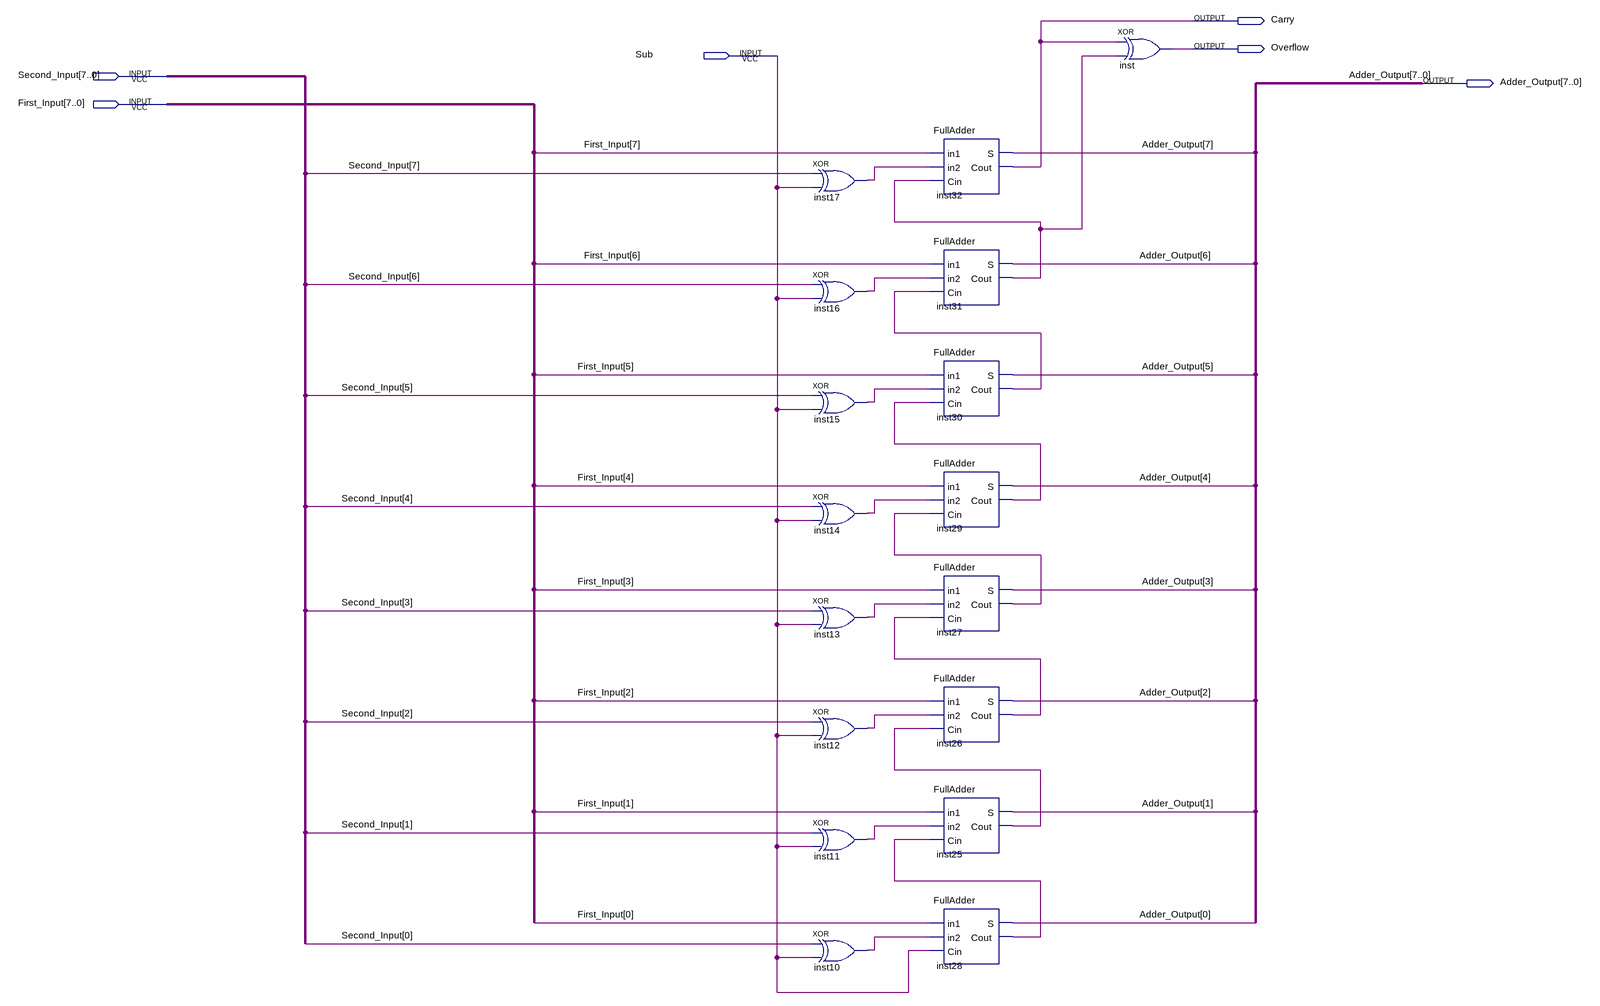
[diagram p0: schematic sheet]
// Quartus schematic 8bitAdder.bdf as structural Verilog: 17 symbols, 6 pins
module \8bitAdder  (
  input  Sub,
  input  [7:0] Second_Input,
  input  [7:0] First_Input,
  output Carry,
  output Overflow,
  output [7:0] Adder_Output
);

  wire inst10_out, inst11_out, inst12_out, inst13_out, inst14_out, inst15_out, inst16_out, inst17_out,
       inst25_cout, inst26_cout, inst27_cout, inst28_cout, inst29_cout, inst30_cout, inst31_cout;

  xor inst17 (inst17_out, Second_Input[7], Sub);
  xor inst16 (inst16_out, Second_Input[6], Sub);
  xor inst15 (inst15_out, Second_Input[5], Sub);
  xor inst14 (inst14_out, Second_Input[4], Sub);
  xor inst13 (inst13_out, Second_Input[3], Sub);
  xor inst12 (inst12_out, Second_Input[2], Sub);
  xor inst11 (inst11_out, Second_Input[1], Sub);
  xor inst10 (inst10_out, Second_Input[0], Sub);
  FullAdder inst32 (.in1(First_Input[7]), .in2(inst17_out), .Cin(inst31_cout), .S(Adder_Output[7]), .Cout(Carry));
  FullAdder inst31 (.in1(First_Input[6]), .in2(inst16_out), .Cin(inst30_cout), .S(Adder_Output[6]), .Cout(inst31_cout));
  FullAdder inst30 (.in1(First_Input[5]), .in2(inst15_out), .Cin(inst29_cout), .S(Adder_Output[5]), .Cout(inst30_cout));
  FullAdder inst29 (.in1(First_Input[4]), .in2(inst14_out), .Cin(inst27_cout), .S(Adder_Output[4]), .Cout(inst29_cout));
  FullAdder inst27 (.in1(First_Input[3]), .in2(inst13_out), .Cin(inst26_cout), .S(Adder_Output[3]), .Cout(inst27_cout));
  FullAdder inst26 (.in1(First_Input[2]), .in2(inst12_out), .Cin(inst25_cout), .S(Adder_Output[2]), .Cout(inst26_cout));
  FullAdder inst25 (.in1(First_Input[1]), .in2(inst11_out), .Cin(inst28_cout), .S(Adder_Output[1]), .Cout(inst25_cout));
  FullAdder inst28 (.in1(First_Input[0]), .in2(inst10_out), .Cin(Sub), .S(Adder_Output[0]), .Cout(inst28_cout));
  xor inst (Overflow, Carry, inst31_cout);
endmodule
